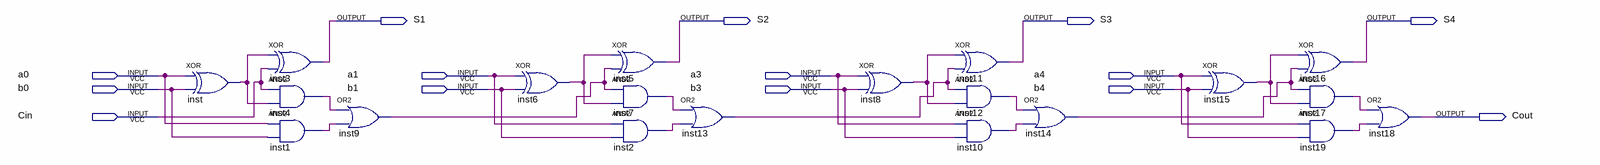
[diagram p0: schematic sheet]
// Quartus schematic 4BitAdder.bdf as structural Verilog: 20 symbols, 14 pins
module \4BitAdder  (
  input  a0,
  input  a1,
  input  a3,
  input  a4,
  input  b0,
  input  b1,
  input  b3,
  input  b4,
  input  Cin,
  output S1,
  output S2,
  output S3,
  output S4,
  output Cout
);

  wire inst1_out, inst2_out, inst4_out, inst6_out, inst7_out, inst8_out, inst9_out, inst10_out, inst12_out,
       inst13_out, inst14_out, inst15_out, inst17_out, inst19_out, inst_out;

  xor inst (inst_out, a0, b0);
  xor inst3 (S1, inst_out, Cin);
  and inst4 (inst4_out, Cin, inst_out);
  and inst1 (inst1_out, a0, b0);
  or inst9 (inst9_out, inst4_out, inst1_out);
  xor inst6 (inst6_out, a1, b1);
  xor inst5 (S2, inst6_out, inst9_out);
  and inst7 (inst7_out, inst9_out, inst6_out);
  and inst2 (inst2_out, a1, b1);
  or inst13 (inst13_out, inst7_out, inst2_out);
  xor inst8 (inst8_out, a3, b3);
  xor inst11 (S3, inst8_out, inst13_out);
  and inst12 (inst12_out, inst13_out, inst8_out);
  and inst10 (inst10_out, a3, b3);
  or inst14 (inst14_out, inst12_out, inst10_out);
  xor inst15 (inst15_out, a4, b4);
  xor inst16 (S4, inst15_out, inst14_out);
  and inst17 (inst17_out, inst14_out, inst15_out);
  and inst19 (inst19_out, a4, b4);
  or inst18 (Cout, inst17_out, inst19_out);
endmodule
